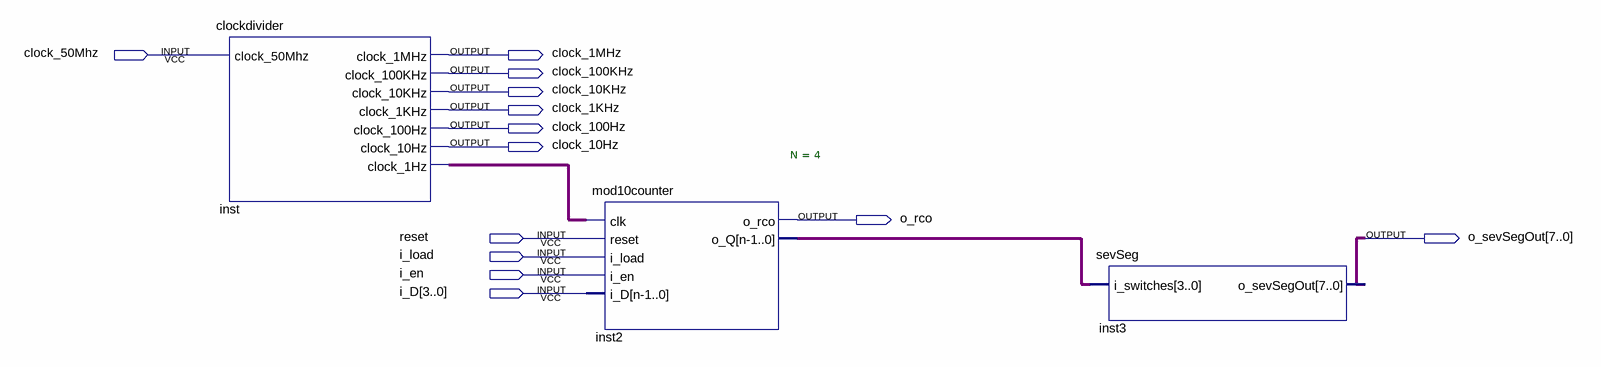
[diagram p0: schematic sheet]
// Quartus schematic mod10countertoSevSeg.bdf as structural Verilog: 3 symbols, 13 pins
module mod10countertoSevSeg (
  input  clock_50Mhz,
  input  reset,
  input  i_load,
  input  i_en,
  input  [3:0] i_D,
  output clock_1MHz,
  output clock_100KHz,
  output clock_10KHz,
  output clock_1KHz,
  output clock_100Hz,
  output clock_10Hz,
  output o_rco,
  output [7:0] o_sevSegOut
);

  wire inst_clock_1hz;
  wire [3:0] inst2_o_q;

  clockdivider inst (
    .clock_50Mhz(clock_50Mhz), .clock_1MHz(clock_1MHz), .clock_100KHz(clock_100KHz),
    .clock_10KHz(clock_10KHz), .clock_1KHz(clock_1KHz), .clock_100Hz(clock_100Hz), .clock_10Hz(clock_10Hz),
    .clock_1Hz(inst_clock_1hz));
  mod10counter #(.N(4)) inst2 (
    .clk(inst_clock_1hz), .reset(reset), .i_load(i_load), .i_en(i_en), .i_D(i_D), .o_rco(o_rco),
    .o_Q(inst2_o_q));
  sevSeg inst3 (.i_switches(inst2_o_q), .o_sevSegOut(o_sevSegOut));
endmodule
